# EAGLE design BESCape (EAGLE 6.5.0)
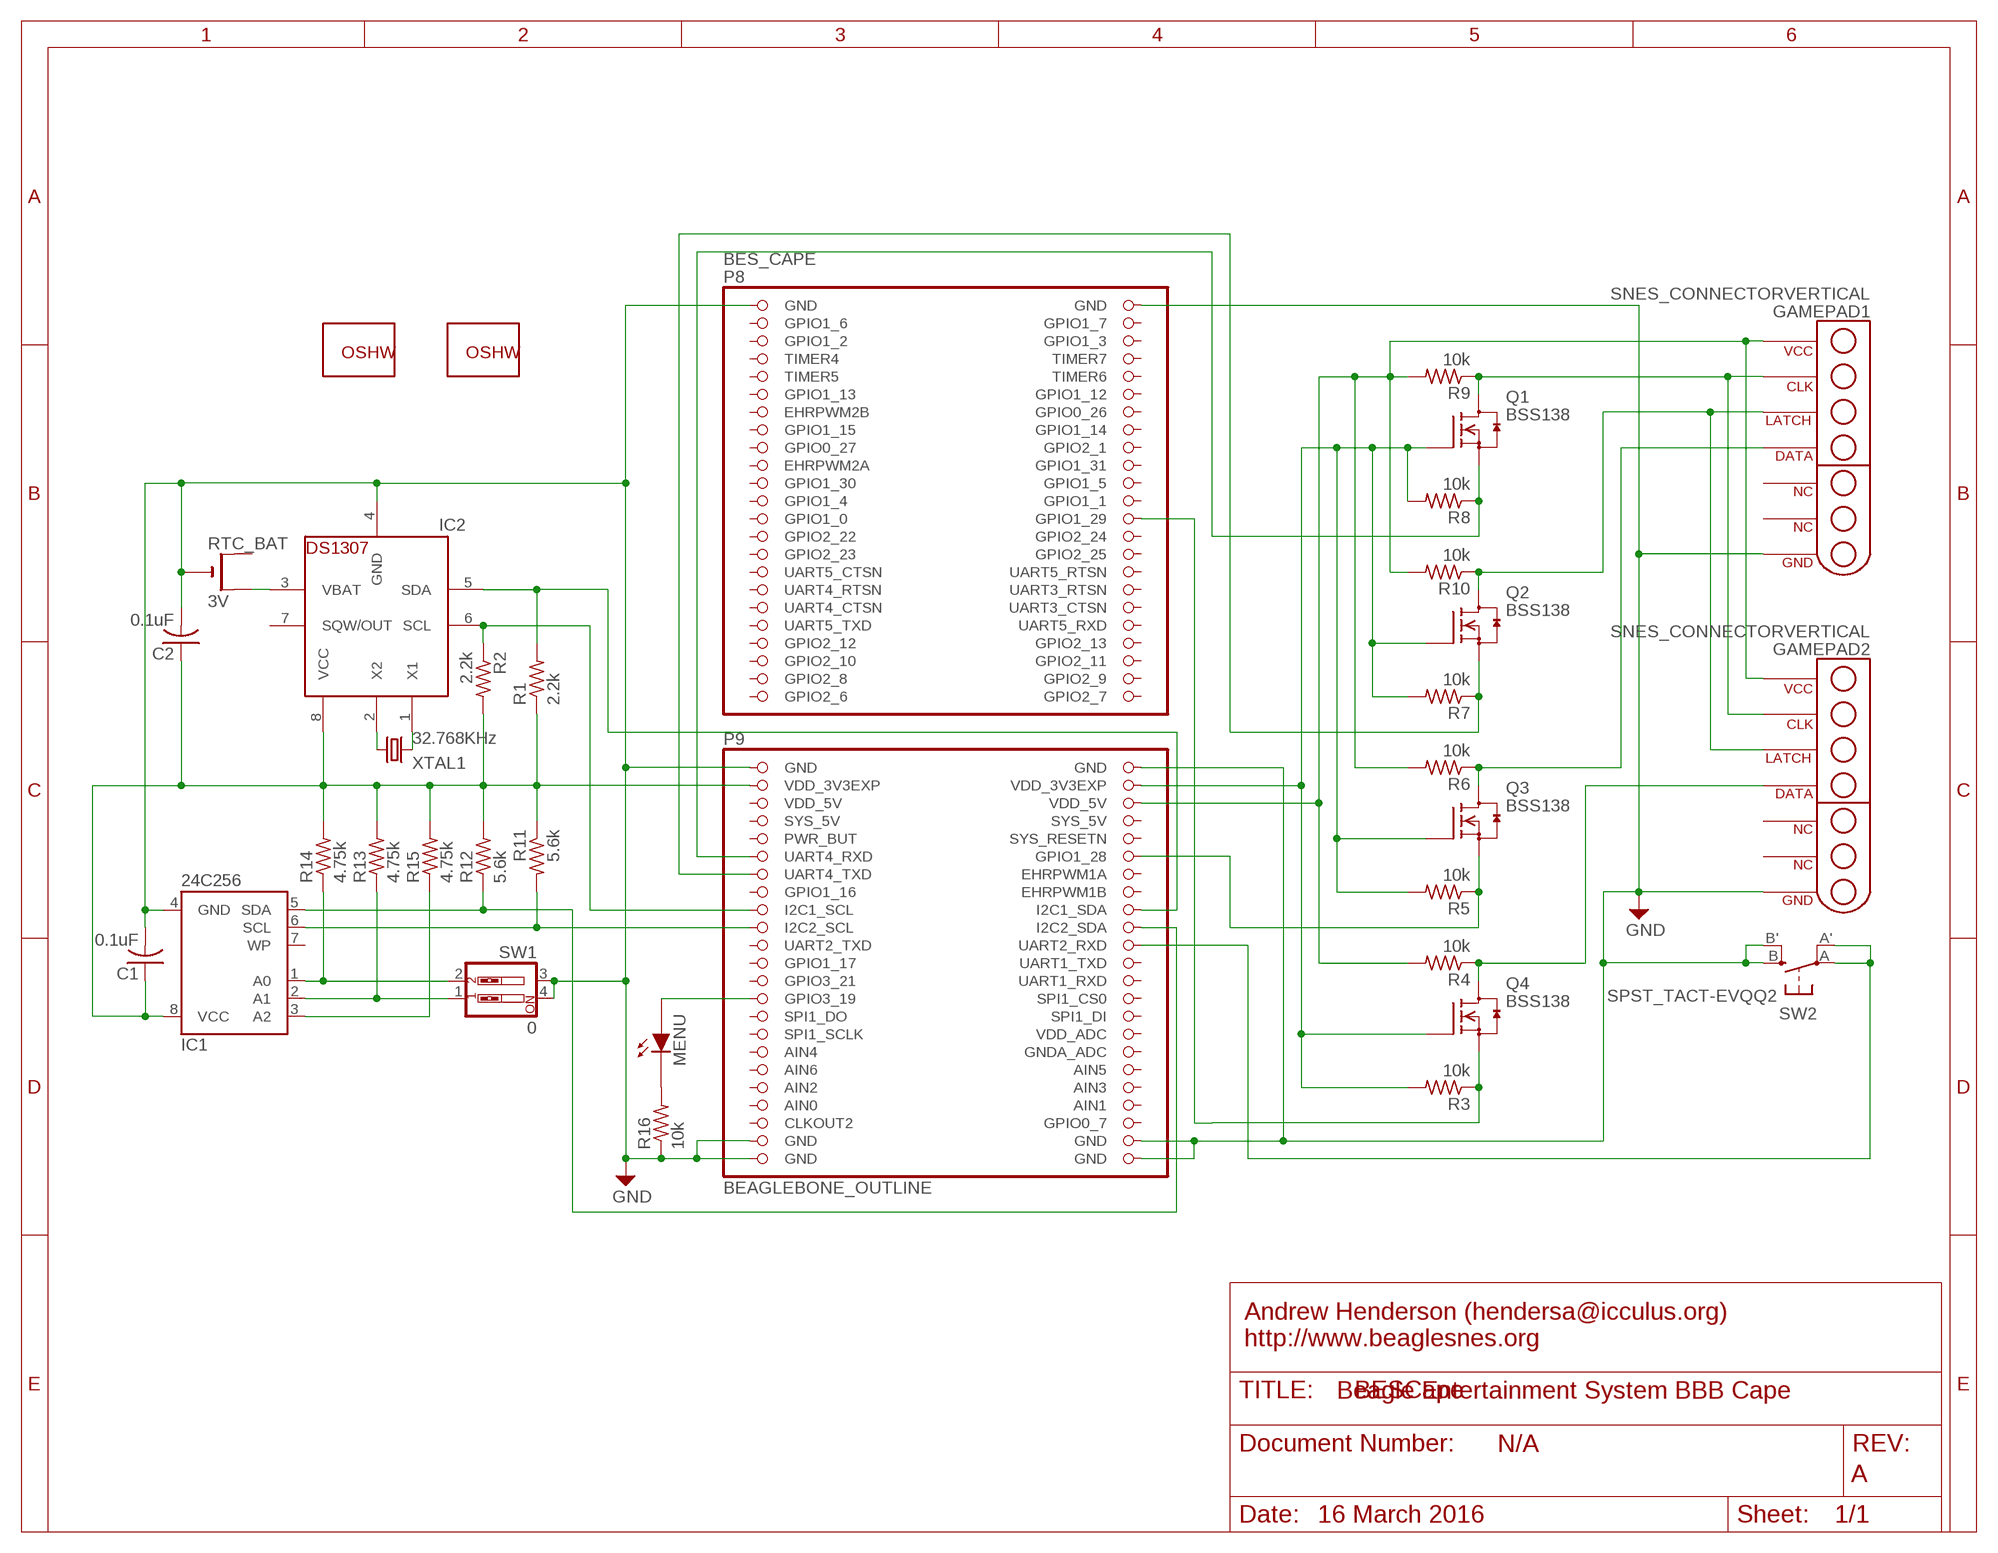
[diagram p0: schematic, sheet 1]

## Parts
BES_CAPE  BEAGLEBONE_OUTLINE  [BEAGLEBONE_SHIELD]
C1  0.1uF  C-USC0805  [C0805]
C2  0.1uF  C-USC0805  [C0805]
GAMEPAD1  SNES_CONNECTORVERTICAL  [SNES_CONNECTOR_VERTICAL]
GAMEPAD2  SNES_CONNECTORVERTICAL  [SNES_CONNECTOR_VERTICAL]
GOLD_ORB_SM1  OSHWLOGO_GOLD_ORB_LG  [OSHW0]
GOLD_ORB_SM3  OSHWLOGO_GOLD_ORB_SM  [OSHW2]
IC1  24C256  AT24CP  [DIL08]
IC2  DS1307  [DIL08]
MENU  LEDD  [1206P]
Q1  BSS138  [SOT23]
Q2  BSS138  [SOT23]
Q3  BSS138  [SOT23]
Q4  BSS138  [SOT23]
R1  2.2k  R-US_R0805  [R0805]
R2  2.2k  R-US_R0805  [R0805]
R3  10k  R-US_R0805  [R0805]
R4  10k  R-US_R0805  [R0805]
R5  10k  R-US_R0805  [R0805]
R6  10k  R-US_R0805  [R0805]
R7  10k  R-US_R0805  [R0805]
R8  10k  R-US_R0805  [R0805]
R9  10k  R-US_R0805  [R0805]
R10  10k  R-US_R0805  [R0805]
R11  5.6k  R-US_R0805  [R0805]
R12  5.6k  R-US_R0805  [R0805]
R13  4.75k  R-US_R0805  [R0805]
R14  4.75k  R-US_R0805  [R0805]
R15  4.75k  R-US_R0805  [R0805]
R16  10k  R-US_R0805  [R0805]
RTC_BAT  3V  CR1220SMT  [CR1220-SMD]
SW1  0  SW_DIP-2  [DIPSWITCH-02]
SW2  SPST_TACT-EVQQ2  [EVQ-Q2]
XTAL1  32.768KHz  CRYSTALTC38H  [TC38H]

## Nets
GND: BES_CAPE.1(GND) BES_CAPE.2(GND) BES_CAPE.47(GND) BES_CAPE.48(GND) BES_CAPE.89(GND) BES_CAPE.90(GND) BES_CAPE.91(GND) BES_CAPE.92(GND) C1.2 C2.2 GAMEPAD1.P$17(GND) GAMEPAD2.P$17(GND) IC1.4(GND) IC2.4(GND) R16.1 RTC_BAT.- SW1.3 SW1.4 SW2.B'(S1) SW2.B(S)
N$1: BES_CAPE.26(GPIO1_29) Q4.2(S) R3.1
N$2: MENU.2(D_OUT) R16.2
N$3: BES_CAPE.73(GPIO3_19) MENU.1(D_IN)
N$5: BES_CAPE.64(I2C1_SDA) IC2.5(SDA) R1.2
N$6: GAMEPAD1.P$13(LATCH) GAMEPAD2.P$13(LATCH) Q2.3(D) R10.1
N$8: IC2.2(X2) XTAL1.1
N$9: IC2.1(X1) XTAL1.2
N$10: GAMEPAD1.P$12(CLK) GAMEPAD2.P$12(CLK) Q1.3(D) R9.1
N$12: BES_CAPE.58(GPIO1_28) Q3.2(S) R5.1
N$13: BES_CAPE.59(UART4_TXD) Q2.2(S) R7.1
N$14: BES_CAPE.68(UART2_RXD) SW2.A'(P1) SW2.A(P)
N$17: IC1.3(A2) R15.1
N$18: IC1.2(A1) R13.1 SW1.1
N$22: BES_CAPE.63(I2C1_SCL) IC2.6(SCL) R2.1
N$24: GAMEPAD2.P$14(DATA) Q4.3(D) R4.1
N$28: GAMEPAD1.P$14(DATA) Q3.3(D) R6.1
N$29: IC1.1(A0) R14.1 SW1.2
N$32: BES_CAPE.65(I2C2_SCL) IC1.6(SCL) R11.2
N$33: BES_CAPE.66(I2C2_SDA) IC1.5(SDA) R12.1
PRU_CLOCK: BES_CAPE.57(UART4_RXD) Q1.2(S) R8.1
VBAT: IC2.3(VBAT) RTC_BAT.+$2(+1)
VCC: BES_CAPE.49(VDD_3V3EXP) C1.1 C2.1 IC1.8(VCC) IC2.8(VCC) R1.1 R2.2 R11.1 R12.2 R13.2 R14.2 R15.2
VDD_3V3EXP: BES_CAPE.50(VDD_3V3EXP) Q1.1(G) Q2.1(G) Q3.1(G) Q4.1(G) R3.2 R5.2 R7.2 R8.2
VDD_5V: BES_CAPE.52(VDD_5V) GAMEPAD1.P$11(VCC) GAMEPAD2.P$11(VCC) R4.2 R6.2 R9.2 R10.2
Unconnected: BES_CAPE.3(GPIO1_6) BES_CAPE.4(GPIO1_7) BES_CAPE.5(GPIO1_2) BES_CAPE.6(GPIO1_3) BES_CAPE.7(TIMER4) BES_CAPE.8(TIMER7) BES_CAPE.9(TIMER5) BES_CAPE.10(TIMER6) BES_CAPE.11(GPIO1_13) BES_CAPE.12(GPIO1_12) BES_CAPE.13(EHRPWM2B) BES_CAPE.14(GPIO0_26) BES_CAPE.15(GPIO1_15) BES_CAPE.16(GPIO1_14) BES_CAPE.17(GPIO0_27) BES_CAPE.18(GPIO2_1) BES_CAPE.19(EHRPWM2A) BES_CAPE.20(GPIO1_31) BES_CAPE.21(GPIO1_30) BES_CAPE.22(GPIO1_5) BES_CAPE.23(GPIO1_4) BES_CAPE.24(GPIO1_1) BES_CAPE.25(GPIO1_0) BES_CAPE.27(GPIO2_22) BES_CAPE.28(GPIO2_24) BES_CAPE.29(GPIO2_23) BES_CAPE.30(GPIO2_25) BES_CAPE.31(UART5_CTSN) BES_CAPE.32(UART5_RTSN) BES_CAPE.33(UART4_RTSN) BES_CAPE.34(UART3_RTSN) BES_CAPE.35(UART4_CTSN) BES_CAPE.36(UART3_CTSN) BES_CAPE.37(UART5_TXD) BES_CAPE.38(UART5_RXD) BES_CAPE.39(GPIO2_12) BES_CAPE.40(GPIO2_13) BES_CAPE.41(GPIO2_10) BES_CAPE.42(GPIO2_11) BES_CAPE.43(GPIO2_8) BES_CAPE.44(GPIO2_9) BES_CAPE.45(GPIO2_6) BES_CAPE.46(GPIO2_7) BES_CAPE.54(SYS_5V) BES_CAPE.55(PWR_BUT) BES_CAPE.56(SYS_RESETN) BES_CAPE.60(EHRPWM1A) BES_CAPE.61(GPIO1_16) BES_CAPE.62(EHRPWM1B) BES_CAPE.67(UART2_TXD) BES_CAPE.69(GPIO1_17) BES_CAPE.70(UART1_TXD) BES_CAPE.71(GPIO3_21) BES_CAPE.72(UART1_RXD) BES_CAPE.74(SPI1_CS0) BES_CAPE.75(SPI1_DO) BES_CAPE.76(SPI1_DI) BES_CAPE.77(SPI1_SCLK) BES_CAPE.78(VDD_ADC) BES_CAPE.79(AIN4) BES_CAPE.80(GNDA_ADC) BES_CAPE.81(AIN6) BES_CAPE.82(AIN5) BES_CAPE.83(AIN2) BES_CAPE.84(AIN3) BES_CAPE.86(AIN1) BES_CAPE.87(CLKOUT2) BES_CAPE.88(GPIO0_7) GAMEPAD1.P$15(NC1) GAMEPAD1.P$16(NC2) GAMEPAD2.P$15(NC1) GAMEPAD2.P$16(NC2) IC1.7(WP) IC2.7(SQW/OUT) RTC_BAT.+$1(+)

## Notes on the sheet
- Andrew Henderson (hendersa@icculus.org)
  http://www.beaglesnes.org
- Beagle Entertainment System BBB Cape
- N/A
- A
- 16 March 2016

## Power pins joined to a net without a drawn wire
AIN0: BES_CAPE.85(AIN0)
SYS_5V: BES_CAPE.53(SYS_5V)
VDD_5V: BES_CAPE.51(VDD_5V)

## Library data of the parts
BES_CAPE = adafruit:BEAGLEBONE_OUTLINE: Should match A3 pinout - but not completely tested
C1 C2 = adafruit:C-US: CAPACITOR, American symbol
GAMEPAD1 GAMEPAD2 = BeagleSNES:SNES_CONNECTOR: Generic SNES connector
GOLD_ORB_SM1 GOLD_ORB_SM3 = NBitWonder:OSHWLOGO: These are Open-Source Hardware logos.
IC1 = atmel:AT24C*: 2-wire serial EEPROM; MPN: AT24C1024BW-SH-B; OC_FARNELL: 1362646; OC_NEWARK: 03P2044
IC2 = adafruit:DS1307: DS1307 Real time clock (RTC) with battery backup ability. Talk to it via i2c
MENU = m-pad-2.1:LED: LED's in various packages
Q1-Q4 = m-pad-2.1:BSS138: Fairchild Semiconductors BSS138 N-Channel Logic Level Enhancement Mode Field Effect Transistor General Description: These N-Channel enhancement mode field effect transistors are produced using Fairchild's proprietary, high cell density, DMOS technology. These products have been designed to minimize on-state resistance while provide rugged, reliable, and fast switching performance.These products are particularly suited for low voltage, low current applications such as small servo motor control, power MOSFET gate drivers, and other switching applications. Features: 0.22 A, 50 V. RDS(ON) = 3.5Ohm @ VGS = 10 V RDS(ON) = 6.0Ohm @ VGS = 4.5 V High density cell design for extremely low RDS(ON) Rugged and Reliable Compact industry standard SOT-23 surface mount package Please send any comments to: messi@users.sourceforge.net
R1-R16 = adafruit:R-US_: RESISTOR, American symbol
RTC_BAT = adafruit:CR1220: CR1216/CR1220/CR1225 12mm 3V lithium coin cell Great for battery packup. Both SMT and THM holders. Note the THM package has the ground pads on both sides of the PCB so that the masks are the same - this reduces the cost
SW1 = SparkFun-Electromechanical:SW_DIP-2: DIP SWITCH
SW2 = adafruit:SPST_TACT: SMT 6mm switch, EVQQ2 series http://www.ladyada.net/library/eagle
XTAL1 = adafruit:CRYSTAL: CRYSTAL; OC_FARNELL: unknown; OC_NEWARK: unknown

## Board
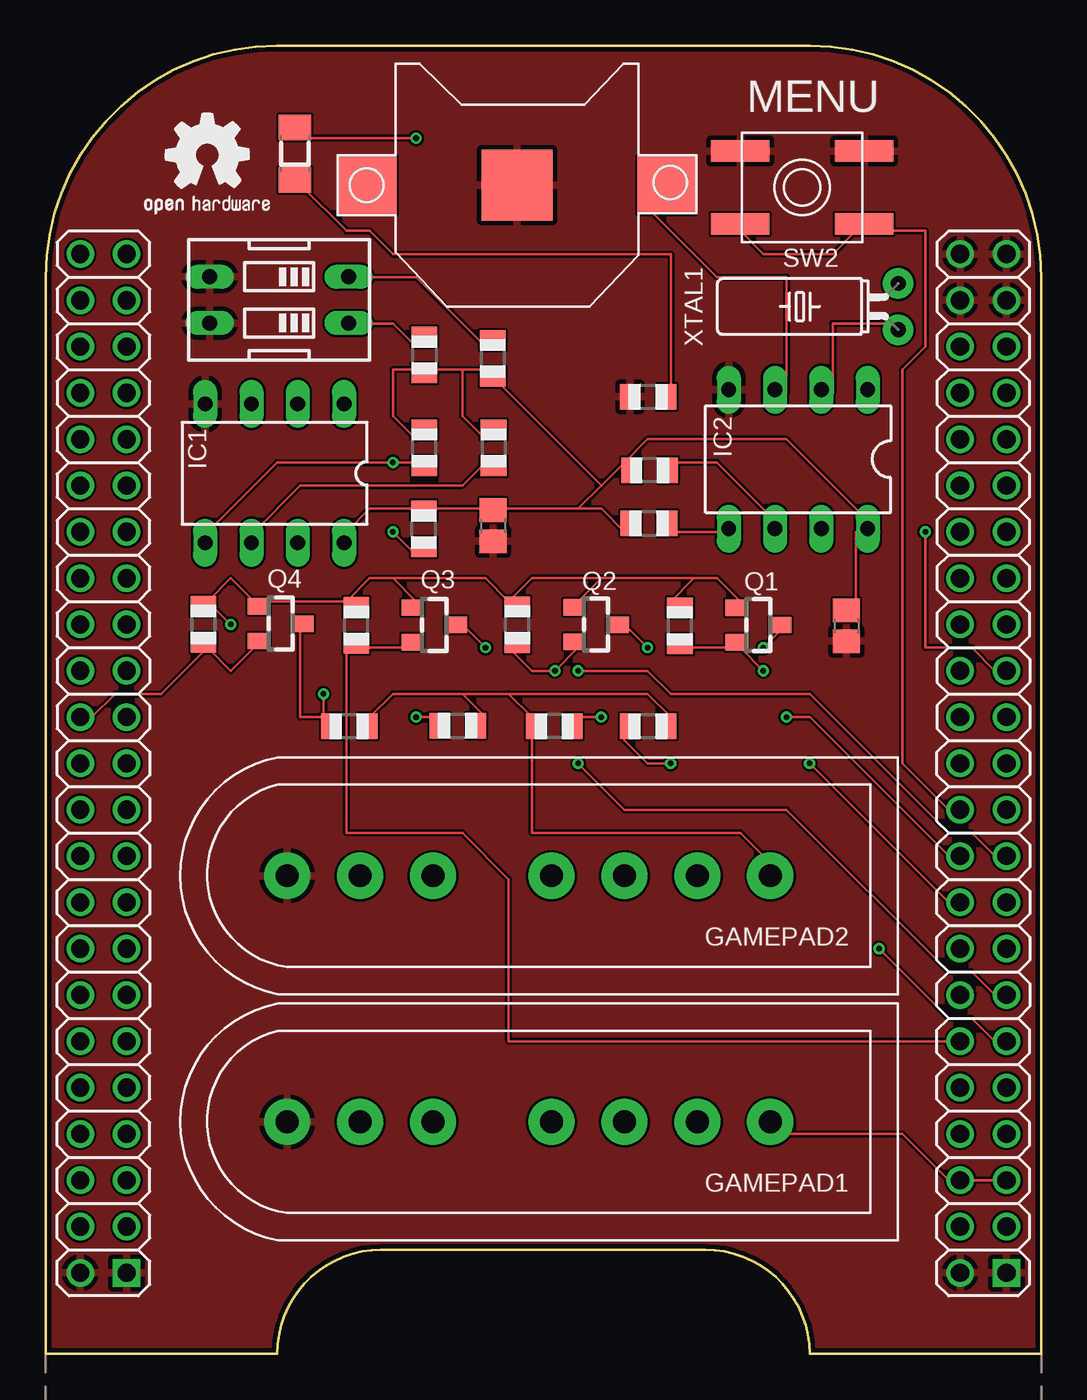
[diagram p1: board, top side]
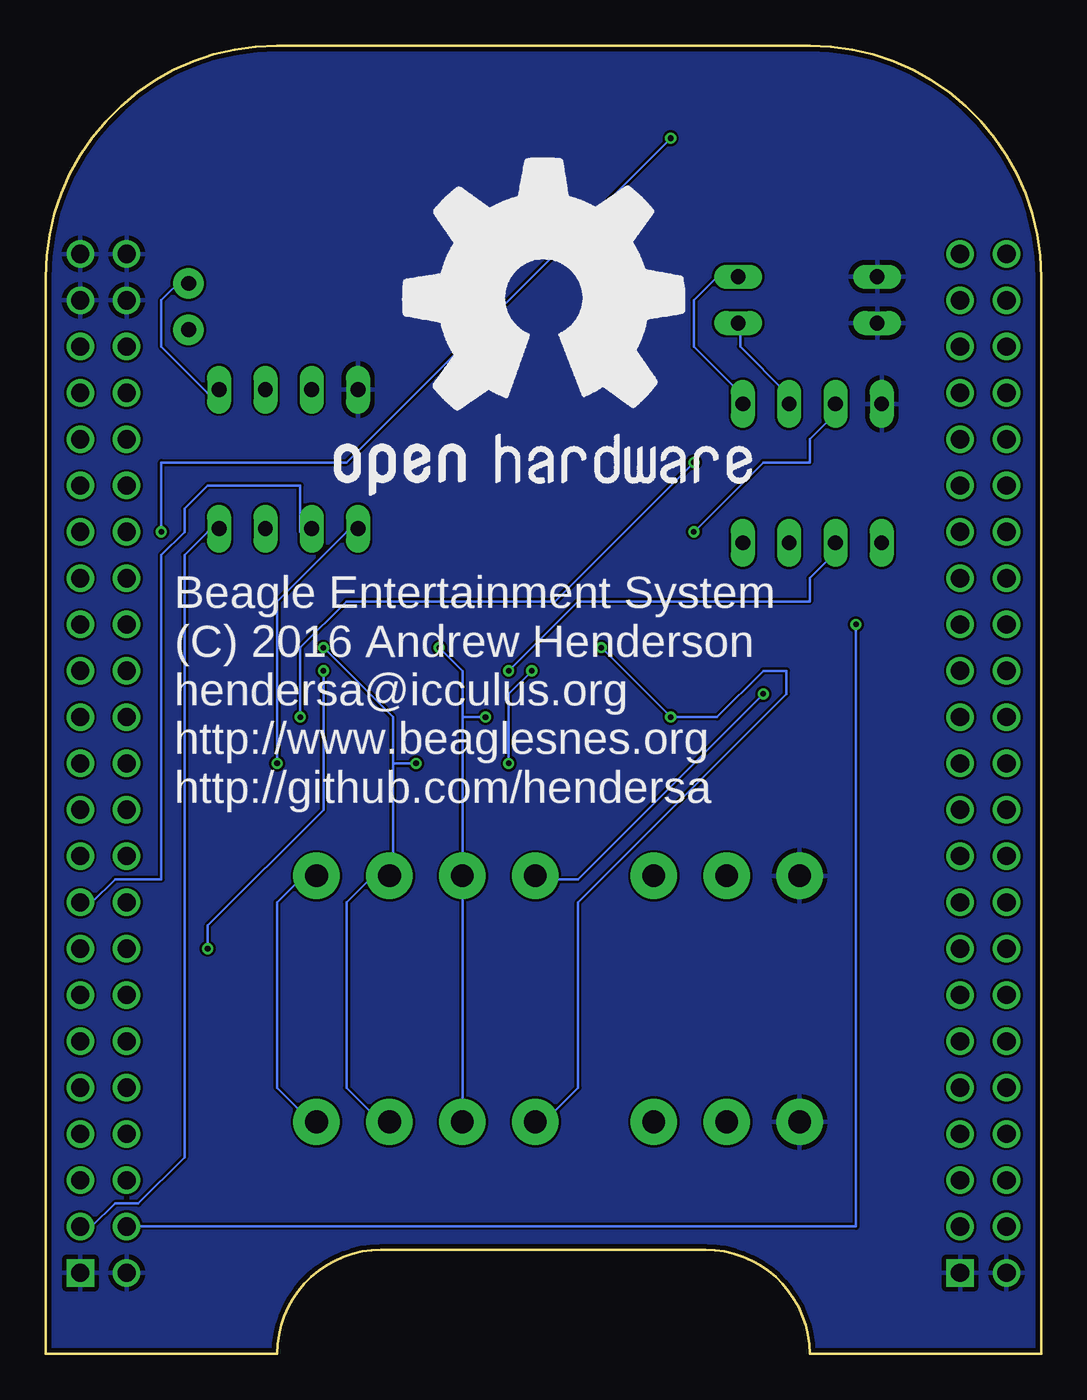
[diagram p2: board, bottom side, seen from below]

Size 54.61 x 71.76 mm. Coordinates in mm from the lower left corner, seen from the top.
Copper layers (1*16): Top 0.035mm / dielectric 1.5mm / Bottom 0.035mm
Design rules "dirt_cheap_dirty_boards.v1": minimum track width 5mil, minimum drill 12mil, track to track 5mil, track to pad 5mil, pad to pad 5mil, via to via 5mil, smd to smd 0mil, copper to edge 10mil, drill to drill 10mil, minimum pad ring 10mil, minimum via ring 6mil, stop-mask expansion 2mil, vias tented up to drill 25mil, thermal gap 10mil

### Footprints (pad centres in the part's own frame; a part is rotated, then mirrored left to right if it is on the bottom)
BEAGLEBONE_SHIELD = drill 1 square: 1 4.445,19.05; 47 52.705,19.05 | drill 1: 2 1.905,19.05; 3 4.445,21.59; 4 1.905,21.59; 5 4.445,24.13; 6 1.905,24.13; 7 4.445,26.67; 8 1.905,26.67; 9 4.445,29.21; 10 1.905,29.21; 11 4.445,31.75; 12 1.905,31.75; 13 4.445,34.29; 14 1.905,34.29; 15 4.445,36.83; 16 1.905,36.83; 17 4.445,39.37; 18 1.905,39.37; 19 4.445,41.91; 20 1.905,41.91; 21 4.445,44.45; 22 1.905,44.45; 23 4.445,46.99; 24 1.905,46.99; 25 4.445,49.53; 26 1.905,49.53; 27 4.445,52.07; 28 1.905,52.07; 29 4.445,54.61; 30 1.905,54.61; 31 4.445,57.15; 32 1.905,57.15; 33 4.445,59.69; 34 1.905,59.69; 35 4.445,62.23; 36 1.905,62.23; 37 4.445,64.77; 38 1.905,64.77; 39 4.445,67.31; 40 1.905,67.31; 41 4.445,69.85; 42 1.905,69.85; 43 4.445,72.39; 44 1.905,72.39; 45 4.445,74.93; 46 1.905,74.93; 48 50.165,19.05; 49 52.705,21.59; 50 50.165,21.59; 51 52.705,24.13; 52 50.165,24.13; 53 52.705,26.67; 54 50.165,26.67; 55 52.705,29.21; 56 50.165,29.21; 57 52.705,31.75; 58 50.165,31.75; 59 52.705,34.29; 60 50.165,34.29; 61 52.705,36.83; 62 50.165,36.83; 63 52.705,39.37; 64 50.165,39.37; 65 52.705,41.91; 66 50.165,41.91; 67 52.705,44.45; 68 50.165,44.45; 69 52.705,46.99; 70 50.165,46.99; 71 52.705,49.53; 72 50.165,49.53; 73 52.705,52.07; 74 50.165,52.07; 75 52.705,54.61; 76 50.165,54.61; 77 52.705,57.15; 78 50.165,57.15; 79 52.705,59.69; 80 50.165,59.69; 81 52.705,62.23; 82 50.165,62.23; 83 52.705,64.77; 84 50.165,64.77; 85 52.705,67.31; 86 50.165,67.31; 87 52.705,69.85; 88 50.165,69.85; 89 52.705,72.39; 90 50.165,72.39; 91 52.705,74.93; 92 50.165,74.93
C0805 = smd 1.3 x 1.5: 1 -0.85,0; 2 0.85,0
SNES_CONNECTOR_VERTICAL = drill 1.25 pad 2.54: P$11 -12,1.5; P$12 -8,1.5; P$13 -4,1.5; P$14 0,1.5; P$15 6.5,1.5; P$16 10.5,1.5; P$17 14.5,1.5
DIL08 = drill 0.813 long: 1 -3.81,-3.81; 2 -1.27,-3.81; 3 1.27,-3.81; 4 3.81,-3.81; 5 3.81,3.81; 6 1.27,3.81; 7 -1.27,3.81; 8 -3.81,3.81
1206P = smd 1.4 x 1.8: 1 -1.45,0; 2 1.45,0
SOT23 = smd 0.9 x 1.2: 1 -0.95,-1.2; 2 0.95,-1.2; 3 0,1.2
R0805 = smd 1.1 x 1.4: 1 -1,0; 2 1,0
CR1220-SMD = smd 3.2 x 3.2: +$1 -8.2,0; +$2 8.2,0 | smd 3.9 x 3.9: - 0,0
DIPSWITCH-02 = drill 0.813 long: 1 -1.27,-3.81; 2 1.27,-3.81; 3 1.27,3.81; 4 -1.27,3.81
EVQ-Q2 = smd 3.2 x 1.2: A -3.4,-2; A' 3.4,-2; B -3.4,2; B' 3.4,2
TC38H = drill 0.813 pad 1.676: 1 -1.27,0; 2 1.27,0

### Placement (x,y rotation side)
BES_CAPE  0,-14.61 0 top
C1  24.55,45.42 270 top
C2  43.92,39.94 270 top
GAMEPAD1  27.75,14.22 180 top
GAMEPAD2  27.75,27.72 180 top
GOLD_ORB_SM1  40.02,43.65 0 bottom
GOLD_ORB_SM3  5.05,61.48 0 top
IC1  12.56,48.3 180 top
IC2  41.28,49.07 180 top
MENU  13.68,65.83 270 top
Q1  39.1,39.97 270 top
Q2  30.2,40 270 top
Q3  21.32,39.98 270 top
Q4  12.89,40.05 270 top
R1  33.09,45.55 0 top
R2  33.12,48.47 180 top
R3  8.66,40 90 top
R4  16.66,34.44 0 top
R5  17.04,39.95 90 top
R6  22.6,34.45 0 top
R7  25.88,40 90 top
R8  34.8,39.94 90 top
R9  33.05,34.44 0 top
R10  27.9,34.44 180 top
R11  24.57,49.69 270 top
R12  20.77,49.7 90 top
R13  20.77,54.78 270 top
R14  24.52,54.6 270 top
R15  20.75,45.25 90 top
R16  33.05,52.5 0 top
RTC_BAT  25.86,64.1 0 top
SW1  12.81,57.81 90 top
SW2  41.5,63.98 0 top
XTAL1  46.77,57.44 90 top

### Tracks (layer width: path | path; a pad name or v marks a point on that pad's centre or on a via)
GND
  pour Bottom: -1.27,71.76 -1.39,71.7 -1.06,-1.27 56.54,-0.75 56.54,-0.03 56.51,71.56
  pour Top: -3.22,73.55 60.2,73.55 60.2,-3.7 -2.88,-3.7 -2.88,73.38
  pour Top: 0.5,51.53 53.93,51.53 53.93,13.22 0.6,13.22 0.6,51.42
N$1
  Top 0.127: 8.89,38.73 10.16,37.47 11.43,38.73 Q4.2 | 8.89,38.73 6.35,36.19 3.81,36.19 2.54,34.92 BES_CAPE.26 | 8.89,38.73 R3.1
N$2
  Top 0.127: R16.2 34.29,52.7 34.29,60.33 19.05,60.33 17.78,61.59 16.51,61.59 13.97,64.14 MENU.2
N$3  (via drill 0.3)
  Top 0.127: v20.32,66.67 13.97,66.67 MENU.1 | v48.26,45.08 48.26,38.73 50.8,38.73 52.07,37.47 BES_CAPE.73
  Bottom 0.127: v20.32,66.67 38.1,48.89 48.26,48.89 v48.26,45.08
N$5  (via drill 0.3)
  Top 0.127: R1.2 34.29,45.08 36.83,45.08 IC2.5 | v41.91,32.39 49.53,24.77 BES_CAPE.64
  Bottom 0.127: v41.91,32.39 41.91,41.28 38.1,45.08 IC2.5
N$6  (via drill 0.3)
  Top 0.127: v33.02,38.73 31.75,40 Q2.3 | v30.48,34.92 29.21,34.92 R10.1
  Bottom 0.127: v33.02,38.73 31.75,37.47 31.75,34.92 | 31.75,34.92 GAMEPAD2.P$13 GAMEPAD1.P$13 | 31.75,34.92 v30.48,34.92
N$8
  Top 0.127: IC2.2 43.18,52.7 43.18,56.52 46.99,56.52 XTAL1.1
N$9
  Bottom 0.127: IC2.1 45.72,52.7 48.26,55.25 48.26,57.78 46.99,59.05 XTAL1.2
N$10  (via drill 0.3)
  Top 0.127: v39.37,38.73 40.64,40 Q1.3 | v34.29,32.39 33.02,32.39 31.75,33.66 31.75,34.92 R9.1
  Bottom 0.127: v39.37,38.73 35.56,34.92 35.56,32.39 | 35.56,32.39 35.56,27.3 GAMEPAD2.P$12 36.83,26.04 38.1,24.77 38.1,14.61 36.83,13.34 GAMEPAD1.P$12 | 35.56,32.39 v34.29,32.39
N$12
  Top 0.127: 16.51,38.73 20.32,38.73 Q3.2 | 16.51,38.73 16.51,28.57 22.86,28.57 25.4,26.04 25.4,17.14 BES_CAPE.58 | 16.51,38.73 R5.1
N$13  (via drill 0.3)
  Top 0.127: Q2.2 29.21,38.73 v27.94,37.47 26.67,37.47 25.4,38.73 R7.1 | v29.21,32.39 31.75,29.85 40.64,29.85 49.53,20.95 50.8,20.95 52.07,19.68 BES_CAPE.59
  Bottom 0.127: v27.94,37.47 29.21,36.19 v29.21,32.39
N$14
  Top 0.127: BES_CAPE.68 49.53,29.85 46.99,32.39 46.99,53.97 48.26,55.25 48.26,61.59 45.72,61.59 SW2.A' 44.45,61.59 43.18,60.33 39.37,60.33 38.1,61.59 SW2.A
N$17  (via drill 0.3)
  Top 0.127: v19.05,45.08 20.32,43.81 R15.1
  Bottom 0.127: v19.05,45.08 15.24,48.89 12.7,48.89 12.7,50.17 11.43,51.44 IC1.3
N$18
  Top 0.127: R13.1 20.32,55.25 19.05,56.52 17.78,56.52 SW1.1
  Bottom 0.127: IC1.2 13.97,52.7 16.51,55.25 16.51,56.52 SW1.1
N$22
  Top 0.127: R2.1 34.29,48.89 36.83,48.89 40.64,45.08 IC2.6
  Bottom 0.127: BES_CAPE.63 52.07,24.77 50.8,26.04 48.26,26.04 48.26,43.81 46.99,45.08 46.99,46.36 45.72,47.62 40.64,47.62 40.64,45.08 IC2.6
N$24  (via drill 0.3)
  Top 0.127: 15.24,34.92 13.97,34.92 13.97,40 Q4.3 | v15.24,36.19 15.24,34.92 | 15.24,34.92 R4.1
  Bottom 0.127: v15.24,36.19 25.4,26.04 26.67,26.04 GAMEPAD2.P$14
N$28  (via drill 0.3)
  Top 0.127: v24.13,38.73 22.86,40 Q3.3 | v20.32,34.92 21.59,34.92 R6.1
  Bottom 0.127: v24.13,38.73 v20.32,34.92 17.78,34.92 15.24,37.47 13.97,37.47 13.97,36.19 25.4,24.77 25.4,14.61 26.67,13.34 GAMEPAD1.P$14
N$29
  Top 0.127: R14.1 24.13,55.25 20.32,59.05 17.78,59.05 SW1.2
  Bottom 0.127: IC1.1 16.51,52.7 19.05,55.25 19.05,57.78 17.78,59.05 SW1.2
N$32  (via drill 0.3)
  Top 0.127: R11.2 24.13,48.89 22.86,47.62 13.97,47.62 11.43,45.08 IC1.6 | v29.21,37.47 33.02,37.47 34.29,36.19 41.91,36.19 49.53,28.57 50.8,28.57 52.07,27.3 BES_CAPE.65
  Bottom 0.127: v29.21,37.47 25.4,41.28 12.7,41.28 12.7,42.55 11.43,43.81 IC1.6
N$33  (via drill 0.3)
  Top 0.127: R12.1 20.32,48.89 v19.05,48.89 12.7,48.89 8.89,45.08 IC1.5 | v40.64,34.92 41.91,34.92 49.53,27.3 BES_CAPE.66
  Bottom 0.127: v40.64,34.92 40.64,38.73 38.1,41.28 26.67,41.28 v19.05,48.89
PRU_CLOCK  (via drill 0.3)
  Top 0.127: 38.1,38.73 34.29,38.73 R8.1 | v39.37,37.47 38.1,38.73 | v45.72,22.22 49.53,18.41 50.8,18.41 52.07,17.14 BES_CAPE.57 | 38.1,38.73 Q1.2
  Bottom 0.127: v39.37,37.47 39.37,29.85 45.72,23.5 v45.72,22.22
VBAT
  Top 0.127: IC2.3 40.64,52.7 40.64,59.05 36.83,59.05 33.02,62.87 RTC_BAT.+$2
VCC
  Top 0.127: 20.32,46.36 17.78,46.36 16.51,45.08 IC1.8 | 20.32,53.97 19.05,53.97 19.05,51.44 20.32,50.17 R12.2 | 20.32,53.97 22.86,53.97 | 22.86,53.97 24.13,53.97 | 20.32,53.97 R13.2 | 22.86,53.97 22.86,51.44 24.13,50.17 R11.1 | 24.13,46.36 29.21,46.36 | 29.21,46.36 30.48,46.36 31.75,45.08 R1.1 | 29.21,46.36 30.48,47.62 | 30.48,47.62 31.75,48.89 | 30.48,47.62 24.13,53.97 | 24.13,53.97 R14.2 | 24.13,46.36 20.32,46.36 | 20.32,46.36 R15.2 | 24.13,46.36 C1.1 | C2.1 44.45,41.28 44.45,45.08 IC2.8 45.72,45.08 40.64,50.17 33.02,50.17 31.75,48.89 | 31.75,48.89 R2.2
  Bottom 0.127: BES_CAPE.49 52.07,6.98 50.8,8.25 49.53,8.25 46.99,10.79 46.99,43.81 45.72,45.08 IC2.8
VDD_3V3EXP  (via drill 0.3)
  Top 0.127: 35.56,42.55 36.83,42.55 38.1,41.28 Q1.1 | 35.56,42.55 34.29,41.28 R8.2 | 30.48,42.55 29.21,41.28 Q2.1 | 35.56,42.55 30.48,42.55 | 25.4,41.28 26.67,42.55 30.48,42.55 | 11.43,41.28 10.16,42.55 8.89,41.28 | 19.05,42.55 20.32,41.28 Q3.1 | 19.05,42.55 17.78,42.55 16.51,41.28 | 16.51,41.28 11.43,41.28 | 11.43,41.28 Q4.1 | 16.51,41.28 R5.2 | 8.89,41.28 v10.16,40 | 8.89,41.28 R3.2 | 25.4,41.28 24.13,42.55 19.05,42.55 | 25.4,41.28 R7.2
  Bottom 0.127: BES_CAPE.50 10.16,6.98 v10.16,40
VDD_5V
  Top 0.127: 22.86,36.19 19.05,36.19 17.78,34.92 R4.2 | 22.86,36.19 24.13,34.92 R6.2 | 25.4,36.19 26.67,34.92 | 22.86,36.19 25.4,36.19 | 25.4,36.19 33.02,36.19 34.29,34.92 R9.2 | BES_CAPE.51 BES_CAPE.52 49.53,9.52 46.99,12.06 40.64,12.06 GAMEPAD1.P$11 | 26.67,34.92 26.67,28.57 38.1,28.57 39.37,27.3 GAMEPAD2.P$11 | 26.67,34.92 R10.2
  Bottom 0.127: GAMEPAD2.P$11 40.64,26.04 41.91,24.77 41.91,14.61 40.64,13.34 GAMEPAD1.P$11

### Text on the board
bPlace: Beagle Entertainment System / (C) 2016 Andrew Henderson / hendersa@icculus.org / http://www.beaglesnes.org / http://github.com/hendersa